# Altium schematic sheet Sensors.SchDoc
size A4; DrawnBy: Emile Renaud; Revision: V1.0; SheetNumber: 5; SheetTotal: 5
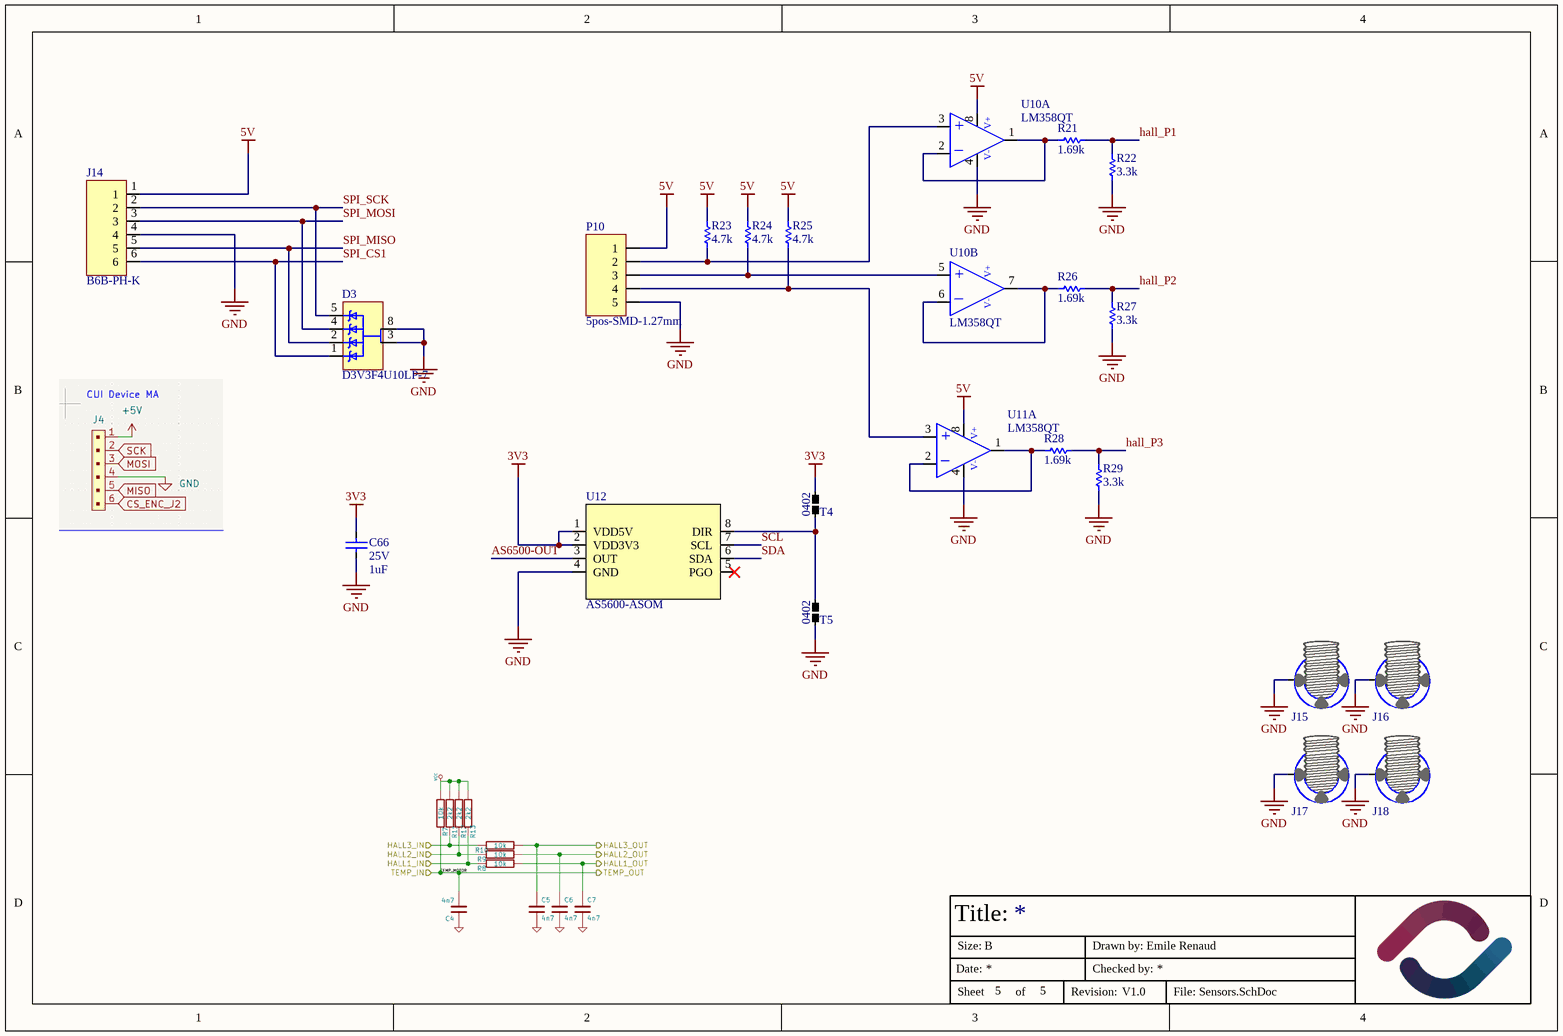
[diagram p0: Sensors.SchDoc]

## Parts
C66  value 1uF  Volt: 25V  [CAPACITOR-0603]  (hidden comment: Capacitor-0603-1uF-25V-X5R)
D3  D3V3F4U10LP-7  [U-DFN2510-10]
J14  B6B-PH-K  [B6B-PH-K]
J15  hole  [HOLE-3.40MM-M3-7MMEYELET-MountingFeature]  (value not drawn)  (no BOM)
J16  hole  [HOLE-3.40MM-M3-7MMEYELET-MountingFeature]  (value not drawn)  (no BOM)
J17  hole  [HOLE-3.40MM-M3-7MMEYELET-MountingFeature]  (value not drawn)  (no BOM)
J18  hole  [HOLE-3.40MM-M3-7MMEYELET-MountingFeature]  (value not drawn)  (no BOM)
P10  5pos-SMD-1.27mm  [HDR1X5-SMD-50mils-SILK]
R21  value 1.69k  [Resistor-0603]  (hidden comment: SMT resistor)
R22  value 3.3k  [Resistor-0603]  (hidden comment: SMT resistor)
R23  value 4.7k  [Resistor-0603]  (hidden comment: SMT resistor)
R24  value 4.7k  [Resistor-0603]  (hidden comment: SMT resistor)
R25  value 4.7k  [Resistor-0603]  (hidden comment: SMT resistor)
R26  value 1.69k  [Resistor-0603]  (hidden comment: SMT resistor)
R27  value 3.3k  [Resistor-0603]  (hidden comment: SMT resistor)
R28  value 1.69k  [Resistor-0603]  (hidden comment: SMT resistor)
R29  value 3.3k  [Resistor-0603]  (hidden comment: SMT resistor)
T4  NetTie_0402  [NetTie-0402]  (value not drawn)
T5  NetTie_0402  [NetTie-0402]  (value not drawn)
U10  LM358QT  [DFN8-2x2]  (parts A,B of 2)
U11  LM358QT  [DFN8-2x2]  (part A of 2)
U12  AS5600-ASOM  [AS5600L-ASOM_AMS]

## Nets
3V3: C66.2 T4.1 U12.1(VDD5V) U12.2(VDD3V3)
5V: J14.1 P10.1 R23.2 R24.2 R25.2 U10.8(VS+) U11.8(VS+)
GND: C66.1 D3.3(L3) D3.8(L4) J14.4 J15.1 J16.1 J17.1 J18.1 P10.5 R22.1 R27.1 R29.1 T5.2 U10.4(VS-) U11.4(VS-) U12.4(GND)
AS6500-OUT: U12.3(OUT)
hall_P1: R21.2 R22.2
hall_P2: R26.2 R27.2
hall_P3: R28.2 R29.2
SCL: U12.7(SCL)
SDA: U12.6(SDA)
SPI_CS1: D3.1(L2) J14.6
SPI_MISO: D3.2(GND) J14.5
SPI_MOSI: D3.4(L4) J14.3
SPI_SCK: D3.5(VDD) J14.2
NetP10_2: P10.2 R23.1 U10.3(IN1+)
NetP10_3: P10.3 R24.1 U10.5(IN2+)
NetP10_4: P10.4 R25.1 U11.3(IN1+)
NetR21_1: R21.1 U10.1(OUT1) U10.2(IN1-)
NetR26_1: R26.1 U10.6(IN2-) U10.7(OUT2)
NetR28_1: R28.1 U11.1(OUT1) U11.2(IN1-)
NetT4_2: T4.2 T5.1 U12.8(DIR)

Not connected (* = marked no-connect by the designer): U12 5(PGO)*

## Notes on the sheet
- Title:
- Date:
- Size:
- B
- Drawn by:
- Checked by:
- Sheet
- of
- Revision:
- File:
- (in symbol LM358QT, part A) V+; +; _; V-
- (in symbol LM358QT, part B) V+; +; _; V-
- (in symbol NetTie_0402) 0402

## Library data of the parts
C66 = Capacitor-0603-1uF-25V-X5R: Precision: X5R-10%; Package / Case: Metric 1608, EIA 0603; Mounted: Yes; Supplier 1: Digi-Key; Supplier Part Number 1: 1276-1859-2-ND; Supplier 2: Digi-Key; Supplier Part Number 2: 1276-1942-2-ND
D3 = D3V3F4U10LP-7: 5V (Typ) Clamp 5A (8/20µs) Ipp Tvs Diode Surface Mount U-DFN2510-10; Supplier 1: Digi-Key; Supplier Part Number 1: D3V3F4U10LP-7DICT-ND; Mounted: Yes; Package / Case: SOT23-6; Volt: 5V
J14 = B6B-PH-K: JST, TH, 6 position 0.079" (2.00mm); Price: None; Value: *; Package: None; Availability: Unavailable; MP: B6B-PH-K; Supplier 1: Digikey; Supplier Part Number 1: 455-B6B-PH-K-ND; HelpURL: https://www.jst-mfg.com/product/pdf/eng/ePH.pdf
J15-J18 = Hole 3.40mm M3-MountingFeature: Hole for M3 Bolt with 7mm pad; Mounted: N/A
R21 R26 R28 = Resistor-0603-1.69k: Resistor0603-1.69k; Precision: 1%; Watt: 0.25W; Mounted: Yes; Package / Case: Metric 1608, EIA 0603; Supplier 1: Digi-Key; Supplier Part Number 1: 311-1.69KHRCT-ND
R22 R27 R29 = Resistor-0603-3.3k: Resistor0603-3.3k; Precision: 5%; Watt: 0.25W; Mounted: Yes; Package / Case: Metric 1608, EIA 0603; Supplier 1: Digi-Key; Supplier Part Number 1: 311-3.30KHRCT-ND
R23-R25 = Resistor-0603-4.7k: Resistor0603-4.7k; Precision: 1%; Watt: 0.1W; Mounted: Yes; Package / Case: Metric 1608, EIA 0603; Supplier 1: Digi-Key; Supplier Part Number 1: 13-RC0603FR-134K7LCT-ND
U10 U11 = LM358QT: General Purpose Amplifier 2 Circuit 8-DFN (2x2); Package / Case: 8-DFN (2x2); Mounted: Yes; Supplier 1: Digikey; Supplier Part Number 1: 497-12007-1-ND; helpURL: https://www.st.com/content/ccc/resource/technical/document/datasheet/61/46/87/01/98/ed/44/c5/CD00000464.pdf/files/CD00000464.pdf/jcr:content/translations/en.CD00000464.pdf
U12 = AS5600-ASOM: SENSOR ANGLE 360DEG SMD; Mfr_Name: ams OSRAM; Manufacturer_Part_Number: AS5600L-ASOM; Copyright: Copyright (C) 2023 Ultra Librarian. All rights reserved.; RefDes: RefDes; Type: DEV
P10 = 5pos-SMD-1.27mm: Supplier 1: Digi-Key; Supplier Part Number 1: N/A; Mounted: Yes; Package / Case: TH; Volt: N/A